# Altium schematic sheet RelayBoard-multi.SchDoc
size A3
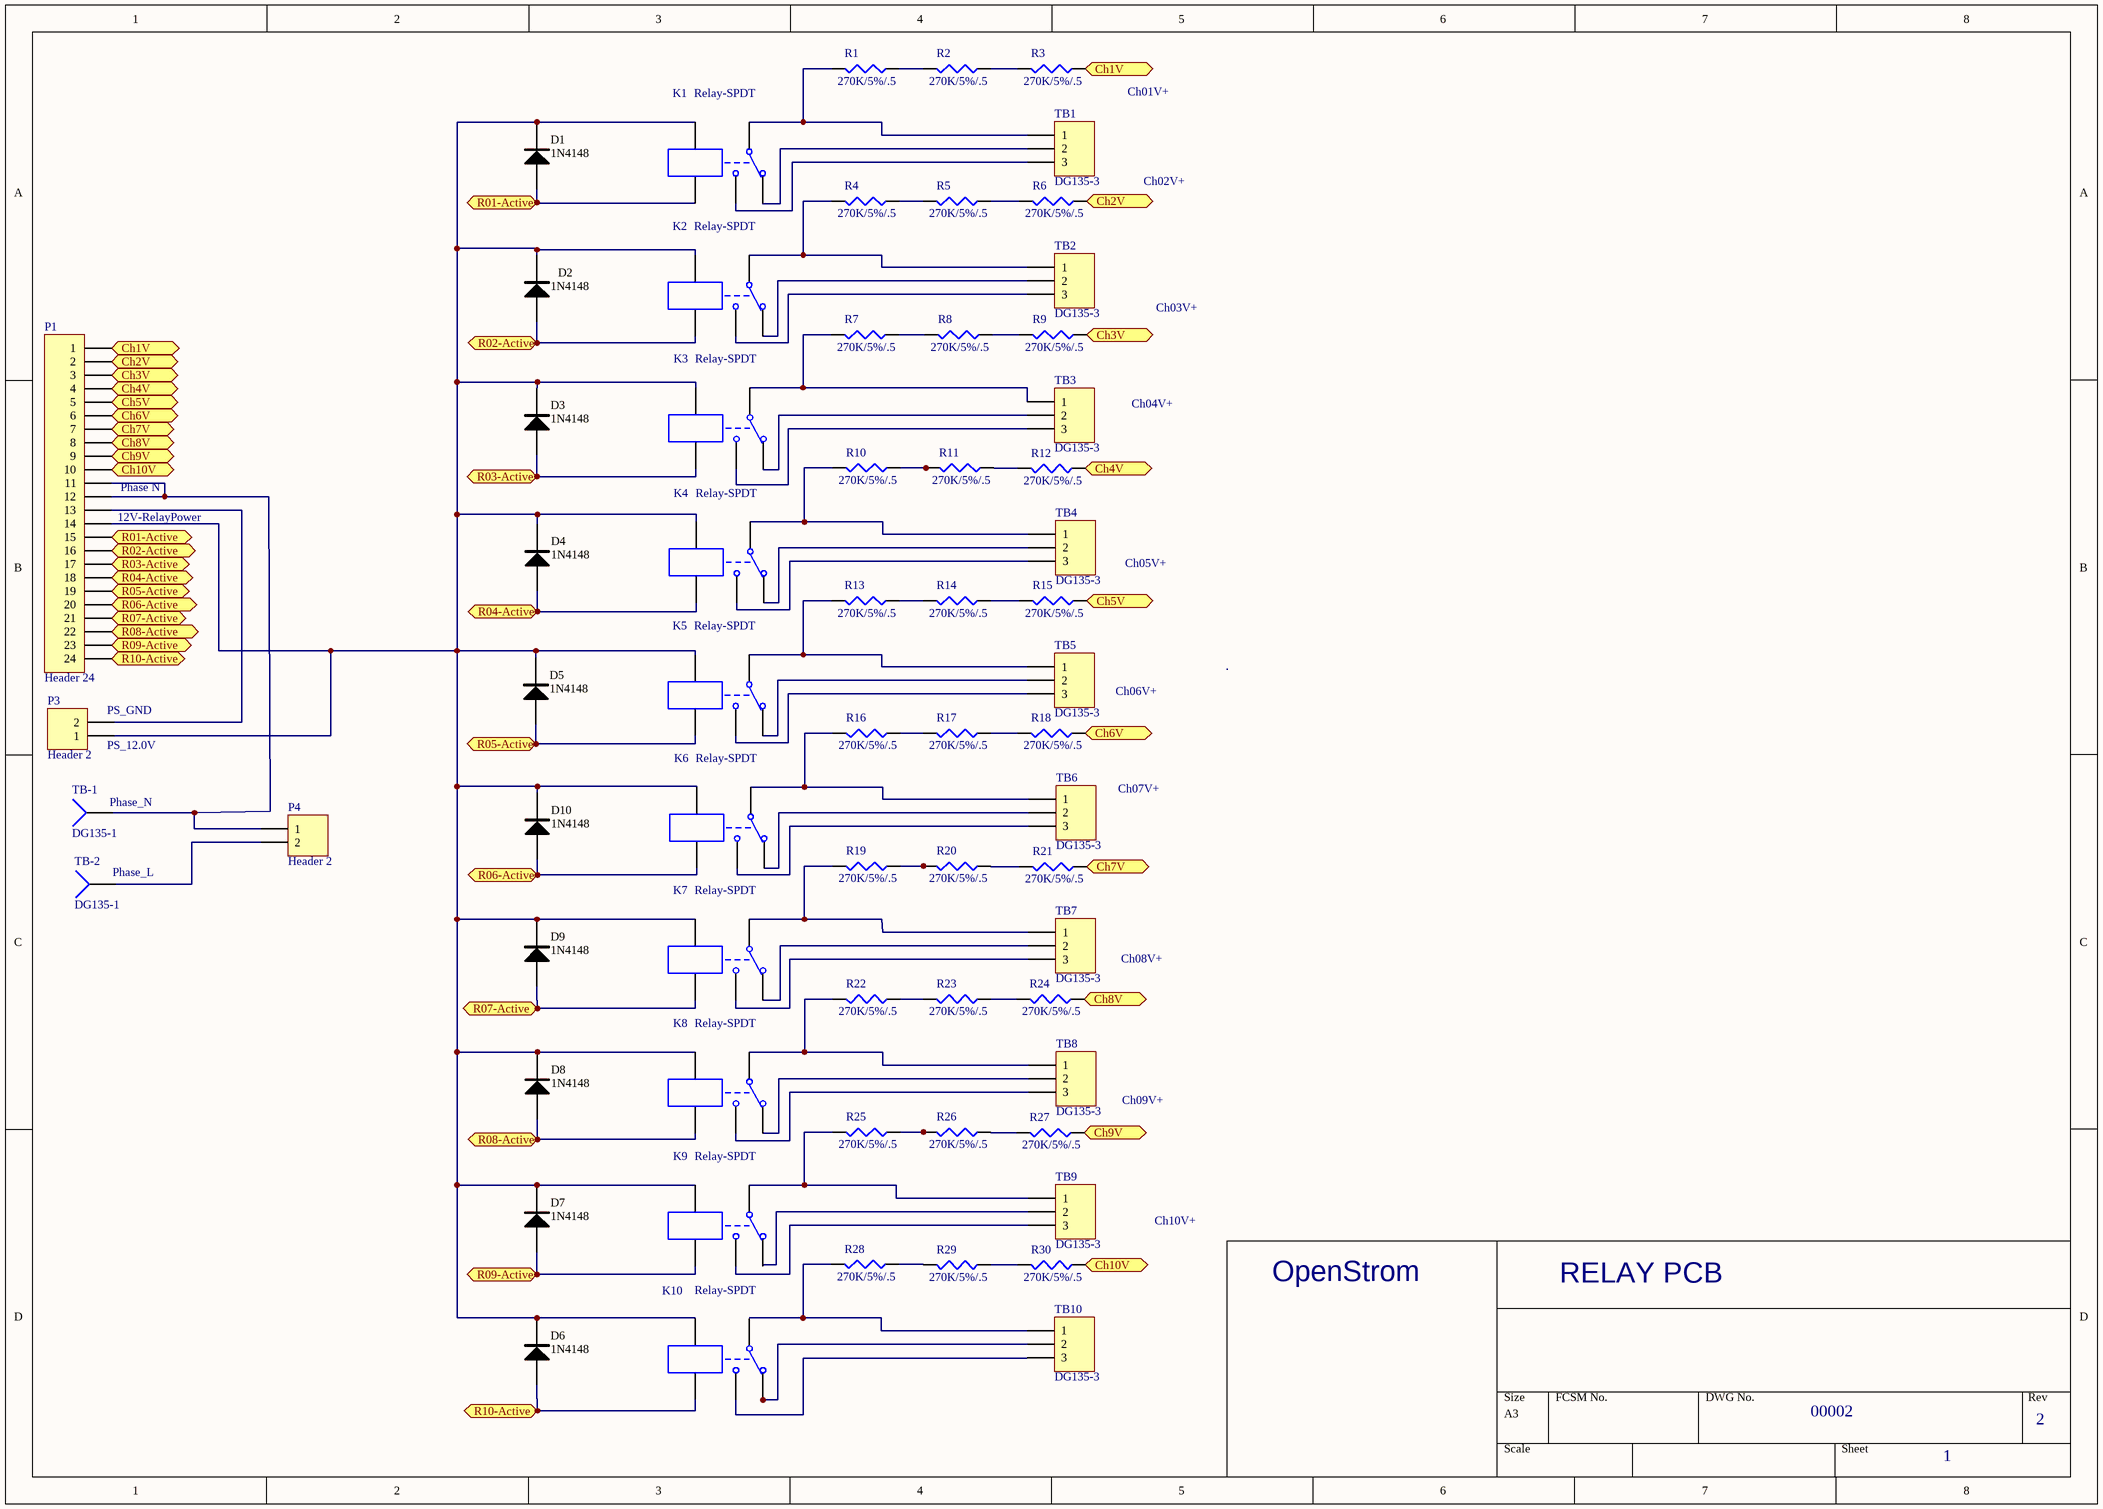
[diagram p0: RelayBoard-multi.SchDoc]

## Parts
D1  1N4148  [SOD523]
D2  1N4148  [SOD523]
D3  1N4148  [SOD523]
D4  1N4148  [SOD523]
D5  1N4148  [SOD523]
D6  1N4148  [SOD523]
D7  1N4148  [SOD523]
D8  1N4148  [SOD523]
D9  1N4148  [SOD523]
D10  1N4148  [SOD523]
K1  Relay-SPDT  [Relay BT90]
K2  Relay-SPDT  [Relay BT90]
K3  Relay-SPDT  [Relay BT90]
K4  Relay-SPDT  [Relay BT90]
K5  Relay-SPDT  [Relay BT90]
K6  Relay-SPDT  [Relay BT90]
K7  Relay-SPDT  [Relay BT90]
K8  Relay-SPDT  [Relay BT90]
K9  Relay-SPDT  [Relay BT90]
K10  Relay-SPDT  [Relay BT90]
P1  Header 24  [HDR1X24]
P3  Header 2  [TermBlock 2.54 2P]
P4  Header 2  [TermBlock 2.54 2P]
R1  270K/5%/.5  [1210C-GENERIC]
R2  270K/5%/.5  [1210C-GENERIC]
R3  270K/5%/.5  [1210C-GENERIC]
R4  270K/5%/.5  [1210C-GENERIC]
R5  270K/5%/.5  [1210C-GENERIC]
R6  270K/5%/.5  [1210C-GENERIC]
R7  270K/5%/.5  [1210C-GENERIC]
R8  270K/5%/.5  [1210C-GENERIC]
R9  270K/5%/.5  [1210C-GENERIC]
R10  270K/5%/.5  [1210C-GENERIC]
R11  270K/5%/.5  [1210C-GENERIC]
R12  270K/5%/.5  [1210C-GENERIC]
R13  270K/5%/.5  [1210C-GENERIC]
R14  270K/5%/.5  [1210C-GENERIC]
R15  270K/5%/.5  [1210C-GENERIC]
R16  270K/5%/.5  [1210C-GENERIC]
R17  270K/5%/.5  [1210C-GENERIC]
R18  270K/5%/.5  [1210C-GENERIC]
R19  270K/5%/.5  [1210C-GENERIC]
R20  270K/5%/.5  [1210C-GENERIC]
R21  270K/5%/.5  [1210C-GENERIC]
R22  270K/5%/.5  [1210C-GENERIC]
R23  270K/5%/.5  [1210C-GENERIC]
R24  270K/5%/.5  [1210C-GENERIC]
R25  270K/5%/.5  [1210C-GENERIC]
R26  270K/5%/.5  [1210C-GENERIC]
R27  270K/5%/.5  [1210C-GENERIC]
R28  270K/5%/.5  [1210C-GENERIC]
R29  270K/5%/.5  [1210C-GENERIC]
R30  270K/5%/.5  [1210C-GENERIC]
TB1  DG135-3  [DG135-1]
TB2  DG135-3  [DG135-1]
TB3  DG135-3  [DG135-1]
TB4  DG135-3  [DG135-1]
TB5  DG135-3  [DG135-1]
TB6  DG135-3  [DG135-1]
TB7  DG135-3  [DG135-1]
TB8  DG135-3  [DG135-1]
TB9  DG135-3  [DG135-1]
TB10  DG135-3  [DG135-1]
TB-1  DG135-1  [DG135-0]
TB-2  DG135-1  [DG135-0]

## Ports
Ch1V, Ch2V, Ch3V, Ch4V, Ch5V, Ch6V, Ch7V, Ch8V, Ch9V, Ch10V, R01-Active, R02-Active, R03-Active, R04-Active, R05-Active, R06-Active, R07-Active, R08-Active, R09-Active, R10-Active

## Nets
Ch1V: P1.1 R3.1 ; port Ch1V
Ch2V: P1.2 R6.1 ; port Ch2V
Ch3V: P1.3 R9.1 ; port Ch3V
Ch4V: P1.4 R12.1 ; port Ch4V
Ch5V: P1.5 R15.1 ; port Ch5V
Ch6V: P1.6 R18.1 ; port Ch6V
Ch7V: P1.7 R21.1 ; port Ch7V
Ch8V: P1.8 R24.1 ; port Ch8V
Ch9V: P1.9 R27.1 ; port Ch9V
Ch10V: P1.10 R30.1 ; port Ch10V
R01-Active: D1.A K1.2 P1.15 ; port R01-Active
R02-Active: D2.A K2.2 P1.16 ; port R02-Active
R03-Active: D3.A K3.2 P1.17 ; port R03-Active
R04-Active: D4.A K4.2 P1.18 ; port R04-Active
R05-Active: D5.A K5.2 P1.19 ; port R05-Active
R06-Active: D10.A K6.2 P1.20 ; port R06-Active
R07-Active: D9.A K7.2 P1.21 ; port R07-Active
R08-Active: D8.A K8.2 P1.22 ; port R08-Active
R09-Active: D7.A K9.2 P1.23 ; port R09-Active
R10-Active: D6.A K10.2 P1.24 ; port R10-Active
NetD1_K: D1.K D2.K D3.K D4.K D5.K D6.K D7.K D8.K D9.K D10.K K1.1 K2.1 K3.1 K4.1 K5.1 K6.1 K7.1 K8.1 K9.1 P1.14 P3.1
NetK1_3: K1.3 TB1.3
NetK1_4: K1.4 R1.2 TB1.1
NetK1_5: K1.5 TB1.2
NetK2_3: K2.3 TB2.3
NetK2_4: K2.4 R4.2 TB2.1
NetK2_5: K2.5 TB2.2
NetK3_3: K3.3 TB3.3
NetK3_4: K3.4 R7.2 TB3.1
NetK3_5: K3.5 TB3.2
NetK4_3: K4.3 TB4.3
NetK4_4: K4.4 R10.2 TB4.1
NetK4_5: K4.5 TB4.2
NetK5_3: K5.3 TB5.3
NetK5_4: K5.4 R13.2 TB5.1
NetK5_5: K5.5 TB5.2
NetK6_3: K6.3 TB6.3
NetK6_4: K6.4 R16.2 TB6.1
NetK6_5: K6.5 TB6.2
NetK7_3: K7.3 TB7.3
NetK7_4: K7.4 R19.2 TB7.1
NetK7_5: K7.5 TB7.2
NetK8_3: K8.3 TB8.3
NetK8_4: K8.4 R22.2 TB8.1
NetK8_5: K8.5 TB8.2
NetK9_3: K9.3 TB9.3
NetK9_4: K9.4 R25.2 TB9.1
NetK9_5: K9.5 TB9.2
NetK10_3: K10.3 TB10.3
NetK10_5: K10.5 TB10.2
NetP1_11: P1.11 P1.12 P4.1 TB-1.1
NetP1_13: P1.13 P3.2
NetP4_2: P4.2 TB-2.1
NetR1_1: R1.1 R2.2
NetR2_1: R2.1 R3.2
NetR4_1: R4.1 R5.2
NetR5_1: R5.1 R6.2
NetR7_1: R7.1 R8.2
NetR8_1: R8.1 R9.2
NetR10_1: R10.1 R11.2
NetR11_1: R11.1 R12.2
NetR13_1: R13.1 R14.2
NetR14_1: R14.1 R15.2
NetR16_1: R16.1 R17.2
NetR17_1: R17.1 R18.2
NetR19_1: R19.1 R20.2
NetR20_1: R20.1 R21.2
NetR22_1: R22.1 R23.2
NetR23_1: R23.1 R24.2
NetR25_1: R25.1 R26.2
NetR26_1: R26.1 R27.2
NetR28_1: R28.1 R29.2
NetR28_2: R28.2 TB10.1
NetR29_1: R29.1 R30.2

Not connected (* = marked no-connect by the designer): K10 1 4

## Notes on the sheet
- Ch01V+
- Ch02V+
- Ch03V+
- Ch04V+
- (near P1) Phase N
- (near P1) 12V-RelayPower
- Ch05V+
- (near P3) PS_GND
- Ch06V+
- (near P3) PS_12.0V
- (near TB-1) Phase_N
- Ch07V+
- (near TB-2) Phase_L
- Ch08V+
- Ch09V+
- Ch10V+
- OpenStrom
- RELAY PCB
- 00002
- 1
- 2

## Library data of the parts
D1 = 1N4001: Manufacturer: Micro Commercial Co; Mfr.PN#: 1N4148X-TP; Suppl.PN#: 1N4148XTPMSCT-ND; Supplier: Digikey; PackageReference: SOD523
D2-D10 = 1N4001
K1-K10 = Relay-SPDT: Single-Pole Dual-Throw Relay; Manufacturer: Yueqing Hengwei Electronics Co.; Mfr.PN#: BT-SS-1-05-D; Suppl.PN#: JQX15F(T90)-40-1C DC12; Published: 24-Mar-1999; LatestRevisionDate: 17-Jul-2002; LatestRevisionNote: Re-released for DXP Platform.; PackageReference: MODULE5B; Publisher: Altium Limited; Supplier: Yueqing Hengwei Electronics Co.; Weblink: *
P1 = Header 24: Header, 24-Pin; Manufacturer: ASSMANN WSW components; Mfr.PN#: AW140-EA-G24I; LatestRevisionDate: 17-Jul-2002; LatestRevisionNote: Re-released for DXP Platform.; Publisher: Altium Limited; Supplier: http://www.tracepartsonline.net/(S(4ypagvgyqx3mb4lo30hzmeaj))/partdetails.aspx?PartID=10-15062010-080061&class=ASSMANN&clsid=/F_ASSMANN/ASSMANN.010/ASSMANN.010.170/
P3 P4 = Header 2: Header, 2-Pin; Manufacturer: TE Connectivity; Mfr.PN#: 282834-2; Suppl.PN#: 650282834-02; LatestRevisionDate: 17-Jul-2002; LatestRevisionNote: Re-released for DXP Platform.; Publisher: Altium Limited; Supplier: Connection Technologies
R1-R30 = Res3: Resistor; Manufacturer: Panasonic; Mfr.PN#: ERJ-14YJ274U; Suppl.PN#: P270KVCT-ND; Published: 8-Jun-2000; LatestRevisionDate: 29-May-2009; LatestRevisionNote: IPC-7351 Footprint Added.; PackageReference: 1210; Publisher: Altium Limited; PackageDescription: Chip Resistor; Supplier: DigiKey
TB1-TB10 = Header 3: Header, 3-Pin; Manufacturer: SMparts/www.smparts.com; Mfr.PN#: DG135T-10.16-04P-13-00A(H)-3pin; Suppl.PN#: DG-135DG135T-10.16-04P-13-00A(H); LatestRevisionDate: 17-Jul-2002; LatestRevisionNote: Re-released for DXP Platform.; Publisher: Altium Limited; Supplier: SMparts/www.smparts.com
TB-1 TB-2 = Socket: Manufacturer: SMparts/www.smparts.com; LatestRevisionDate: 17-Jul-2002; LatestRevisionNote: Re-released for DXP Platform.; Publisher: Altium Limited; Mfr.PN#: SMparts/www.smparts.com; Supplier: SMparts/www.smparts.com; Suppl.PN#: SMparts/www.smparts.com